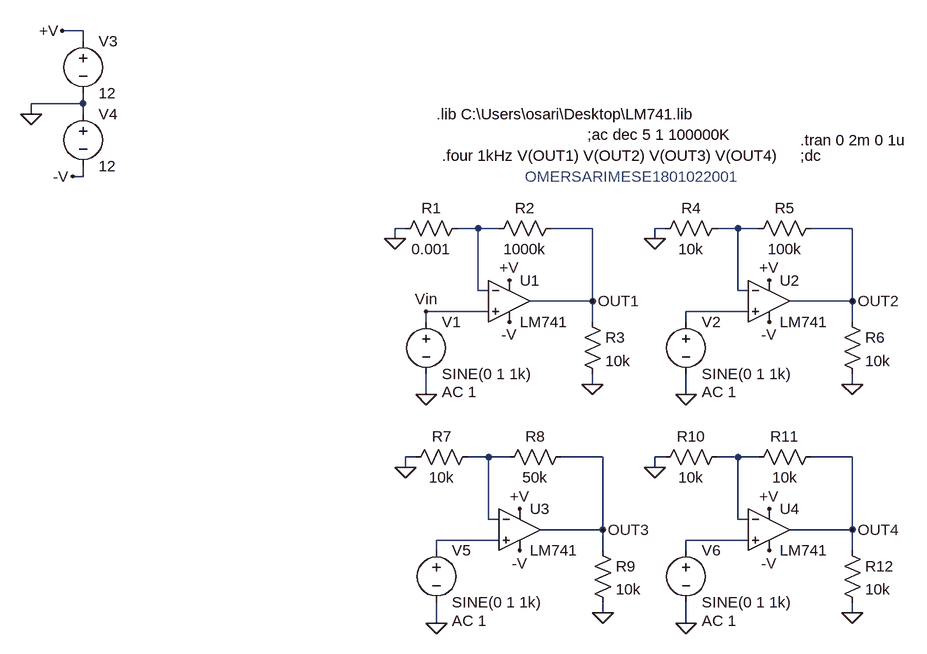
[diagram p0: schematic Draft2.asc]
Draft2.asc, the LTspice schematic file:
Version 4
SHEET 1 884 852
WIRE -560 -96 -592 -96
WIRE -560 -80 -560 -96
WIRE -560 16 -560 0
WIRE -560 16 -640 16
WIRE -640 32 -640 16
WIRE -560 32 -560 16
WIRE -560 128 -560 112
WIRE -560 128 -576 128
WIRE -64 208 -80 208
WIRE 48 208 16 208
WIRE 80 208 48 208
WIRE 224 208 160 208
WIRE 336 208 320 208
WIRE 448 208 416 208
WIRE 480 208 448 208
WIRE 624 208 560 208
WIRE -80 224 -80 208
WIRE 320 224 320 208
WIRE 48 304 48 208
WIRE 64 304 48 304
WIRE 448 304 448 208
WIRE 464 304 448 304
WIRE 224 320 224 208
WIRE 224 320 128 320
WIRE 624 320 624 208
WIRE 624 320 528 320
WIRE 64 336 -32 336
WIRE 464 336 368 336
WIRE -32 352 -32 336
WIRE 224 352 224 320
WIRE 368 352 368 336
WIRE 624 352 624 320
WIRE 224 448 224 432
WIRE 624 448 624 432
WIRE -32 464 -32 432
WIRE 368 464 368 432
WIRE -48 560 -64 560
WIRE 64 560 32 560
WIRE 96 560 64 560
WIRE 240 560 176 560
WIRE 336 560 320 560
WIRE 448 560 416 560
WIRE 480 560 448 560
WIRE 624 560 560 560
WIRE -64 576 -64 560
WIRE 320 576 320 560
WIRE 64 656 64 560
WIRE 80 656 64 656
WIRE 448 656 448 560
WIRE 464 656 448 656
WIRE 240 672 240 560
WIRE 240 672 144 672
WIRE 624 672 624 560
WIRE 624 672 528 672
WIRE 80 688 -16 688
WIRE 464 688 368 688
WIRE -16 704 -16 688
WIRE 240 704 240 672
WIRE 368 704 368 688
WIRE 624 704 624 672
WIRE 240 800 240 784
WIRE 624 800 624 784
WIRE -16 816 -16 784
WIRE 368 816 368 784
FLAG -32 464 0
FLAG -640 32 0
FLAG -592 -96 +V
FLAG -576 128 -V
FLAG 96 288 +V
FLAG 96 352 -V
FLAG 224 320 OUT1
FLAG -32 336 Vin
FLAG -80 224 0
FLAG 224 448 0
FLAG 368 464 0
FLAG 496 288 +V
FLAG 496 352 -V
FLAG 624 320 OUT2
FLAG 320 224 0
FLAG 624 448 0
FLAG -16 816 0
FLAG 112 640 +V
FLAG 112 704 -V
FLAG 240 672 OUT3
FLAG -64 576 0
FLAG 240 800 0
FLAG 368 816 0
FLAG 496 640 +V
FLAG 496 704 -V
FLAG 624 672 OUT4
FLAG 320 576 0
FLAG 624 800 0
SYMBOL voltage -32 336 R0
WINDOW 123 24 124 Left 2
WINDOW 39 0 0 Left 0
SYMATTR InstName V1
SYMATTR Value SINE(0 1 1k)
SYMATTR Value2 AC 1
SYMBOL OpAmps\\opamp2 96 256 R0
SYMATTR InstName U1
SYMATTR Value LM741
SYMBOL voltage -560 -96 R0
WINDOW 123 0 0 Left 0
WINDOW 39 0 0 Left 0
SYMATTR InstName V3
SYMATTR Value 12
SYMBOL voltage -560 16 R0
WINDOW 123 0 0 Left 0
WINDOW 39 0 0 Left 0
SYMATTR InstName V4
SYMATTR Value 12
SYMBOL res 32 192 R90
WINDOW 0 0 56 VBottom 2
WINDOW 3 32 56 VTop 2
SYMATTR InstName R1
SYMATTR Value 0.001
SYMBOL res 176 192 R90
WINDOW 0 0 56 VBottom 2
WINDOW 3 32 56 VTop 2
SYMATTR InstName R2
SYMATTR Value 1000k
SYMBOL res 208 336 R0
SYMATTR InstName R3
SYMATTR Value 10k
SYMBOL voltage 368 336 R0
WINDOW 123 24 124 Left 2
WINDOW 39 0 0 Left 0
SYMATTR InstName V2
SYMATTR Value SINE(0 1 1k)
SYMATTR Value2 AC 1
SYMBOL OpAmps\\opamp2 496 256 R0
SYMATTR InstName U2
SYMATTR Value LM741
SYMBOL res 432 192 R90
WINDOW 0 0 56 VBottom 2
WINDOW 3 32 56 VTop 2
SYMATTR InstName R4
SYMATTR Value 10k
SYMBOL res 576 192 R90
WINDOW 0 0 56 VBottom 2
WINDOW 3 32 56 VTop 2
SYMATTR InstName R5
SYMATTR Value 100k
SYMBOL res 608 336 R0
SYMATTR InstName R6
SYMATTR Value 10k
SYMBOL voltage -16 688 R0
WINDOW 123 24 124 Left 2
WINDOW 39 0 0 Left 0
SYMATTR InstName V5
SYMATTR Value SINE(0 1 1k)
SYMATTR Value2 AC 1
SYMBOL OpAmps\\opamp2 112 608 R0
SYMATTR InstName U3
SYMATTR Value LM741
SYMBOL res 48 544 R90
WINDOW 0 0 56 VBottom 2
WINDOW 3 32 56 VTop 2
SYMATTR InstName R7
SYMATTR Value 10k
SYMBOL res 192 544 R90
WINDOW 0 0 56 VBottom 2
WINDOW 3 32 56 VTop 2
SYMATTR InstName R8
SYMATTR Value 50k
SYMBOL res 224 688 R0
SYMATTR InstName R9
SYMATTR Value 10k
SYMBOL voltage 368 688 R0
WINDOW 123 24 124 Left 2
WINDOW 39 0 0 Left 0
SYMATTR InstName V6
SYMATTR Value SINE(0 1 1k)
SYMATTR Value2 AC 1
SYMBOL OpAmps\\opamp2 496 608 R0
SYMATTR InstName U4
SYMATTR Value LM741
SYMBOL res 432 544 R90
WINDOW 0 0 56 VBottom 2
WINDOW 3 32 56 VTop 2
SYMATTR InstName R10
SYMATTR Value 10k
SYMBOL res 576 544 R90
WINDOW 0 0 56 VBottom 2
WINDOW 3 32 56 VTop 2
SYMATTR InstName R11
SYMATTR Value 10k
SYMBOL res 608 688 R0
SYMATTR InstName R12
SYMATTR Value 10k
TEXT -16 32 Left 2 !.lib C:\\Users\\osari\\Desktop\\LM741.lib
TEXT 544 96 Left 2 !;dc
TEXT 544 72 Left 2 !.tran 0 2m 0 1u
TEXT 216 64 Left 2 !;ac dec 5 1 100000K
TEXT -8 96 Left 2 !.four 1kHz V(OUT1) V(OUT2) V(OUT3) V(OUT4)
TEXT 120 128 Left 2 ;OMERSARIMESE1801022001

The netlist it stands for:
* Draft2.asc
V1 Vin 0 SINE(0 1 1k) AC 1
XU1 Vin N001 +V -V OUT1 LM741  ; pins In+ In- V+ V- OUT
V3 +V 0 12
V4 0 -V 12
R1 N001 0 0.001
R2 OUT1 N001 1000k
R3 OUT1 0 10k
V2 N003 0 SINE(0 1 1k) AC 1
XU2 N003 N002 +V -V OUT2 LM741  ; pins In+ In- V+ V- OUT
R4 N002 0 10k
R5 OUT2 N002 100k
R6 OUT2 0 10k
V5 N006 0 SINE(0 1 1k) AC 1
XU3 N006 N004 +V -V OUT3 LM741  ; pins In+ In- V+ V- OUT
R7 N004 0 10k
R8 OUT3 N004 50k
R9 OUT3 0 10k
V6 N007 0 SINE(0 1 1k) AC 1
XU4 N007 N005 +V -V OUT4 LM741  ; pins In+ In- V+ V- OUT
R10 N005 0 10k
R11 OUT4 N005 10k
R12 OUT4 0 10k
.lib C:\Users\osari\Desktop\LM741.lib
;dc
.tran 0 2m 0 1u
;ac dec 5 1 100000K
.four 1kHz V(OUT1) V(OUT2) V(OUT3) V(OUT4)
* OMERSARIMESE1801022001
.backanno
.end